# EasyEDA Pro project ESC.epro

# Schematic Schematic1
Board Name: Board1; Create Date: 2024-12-03; Page Name: P1; Project Name: 圈圈机机架电调集成; Schematic Name: Schematic1; Update Date: 2025-01-17; Company: 嘉立创EDA; Page Size: A4; Version: V1.0
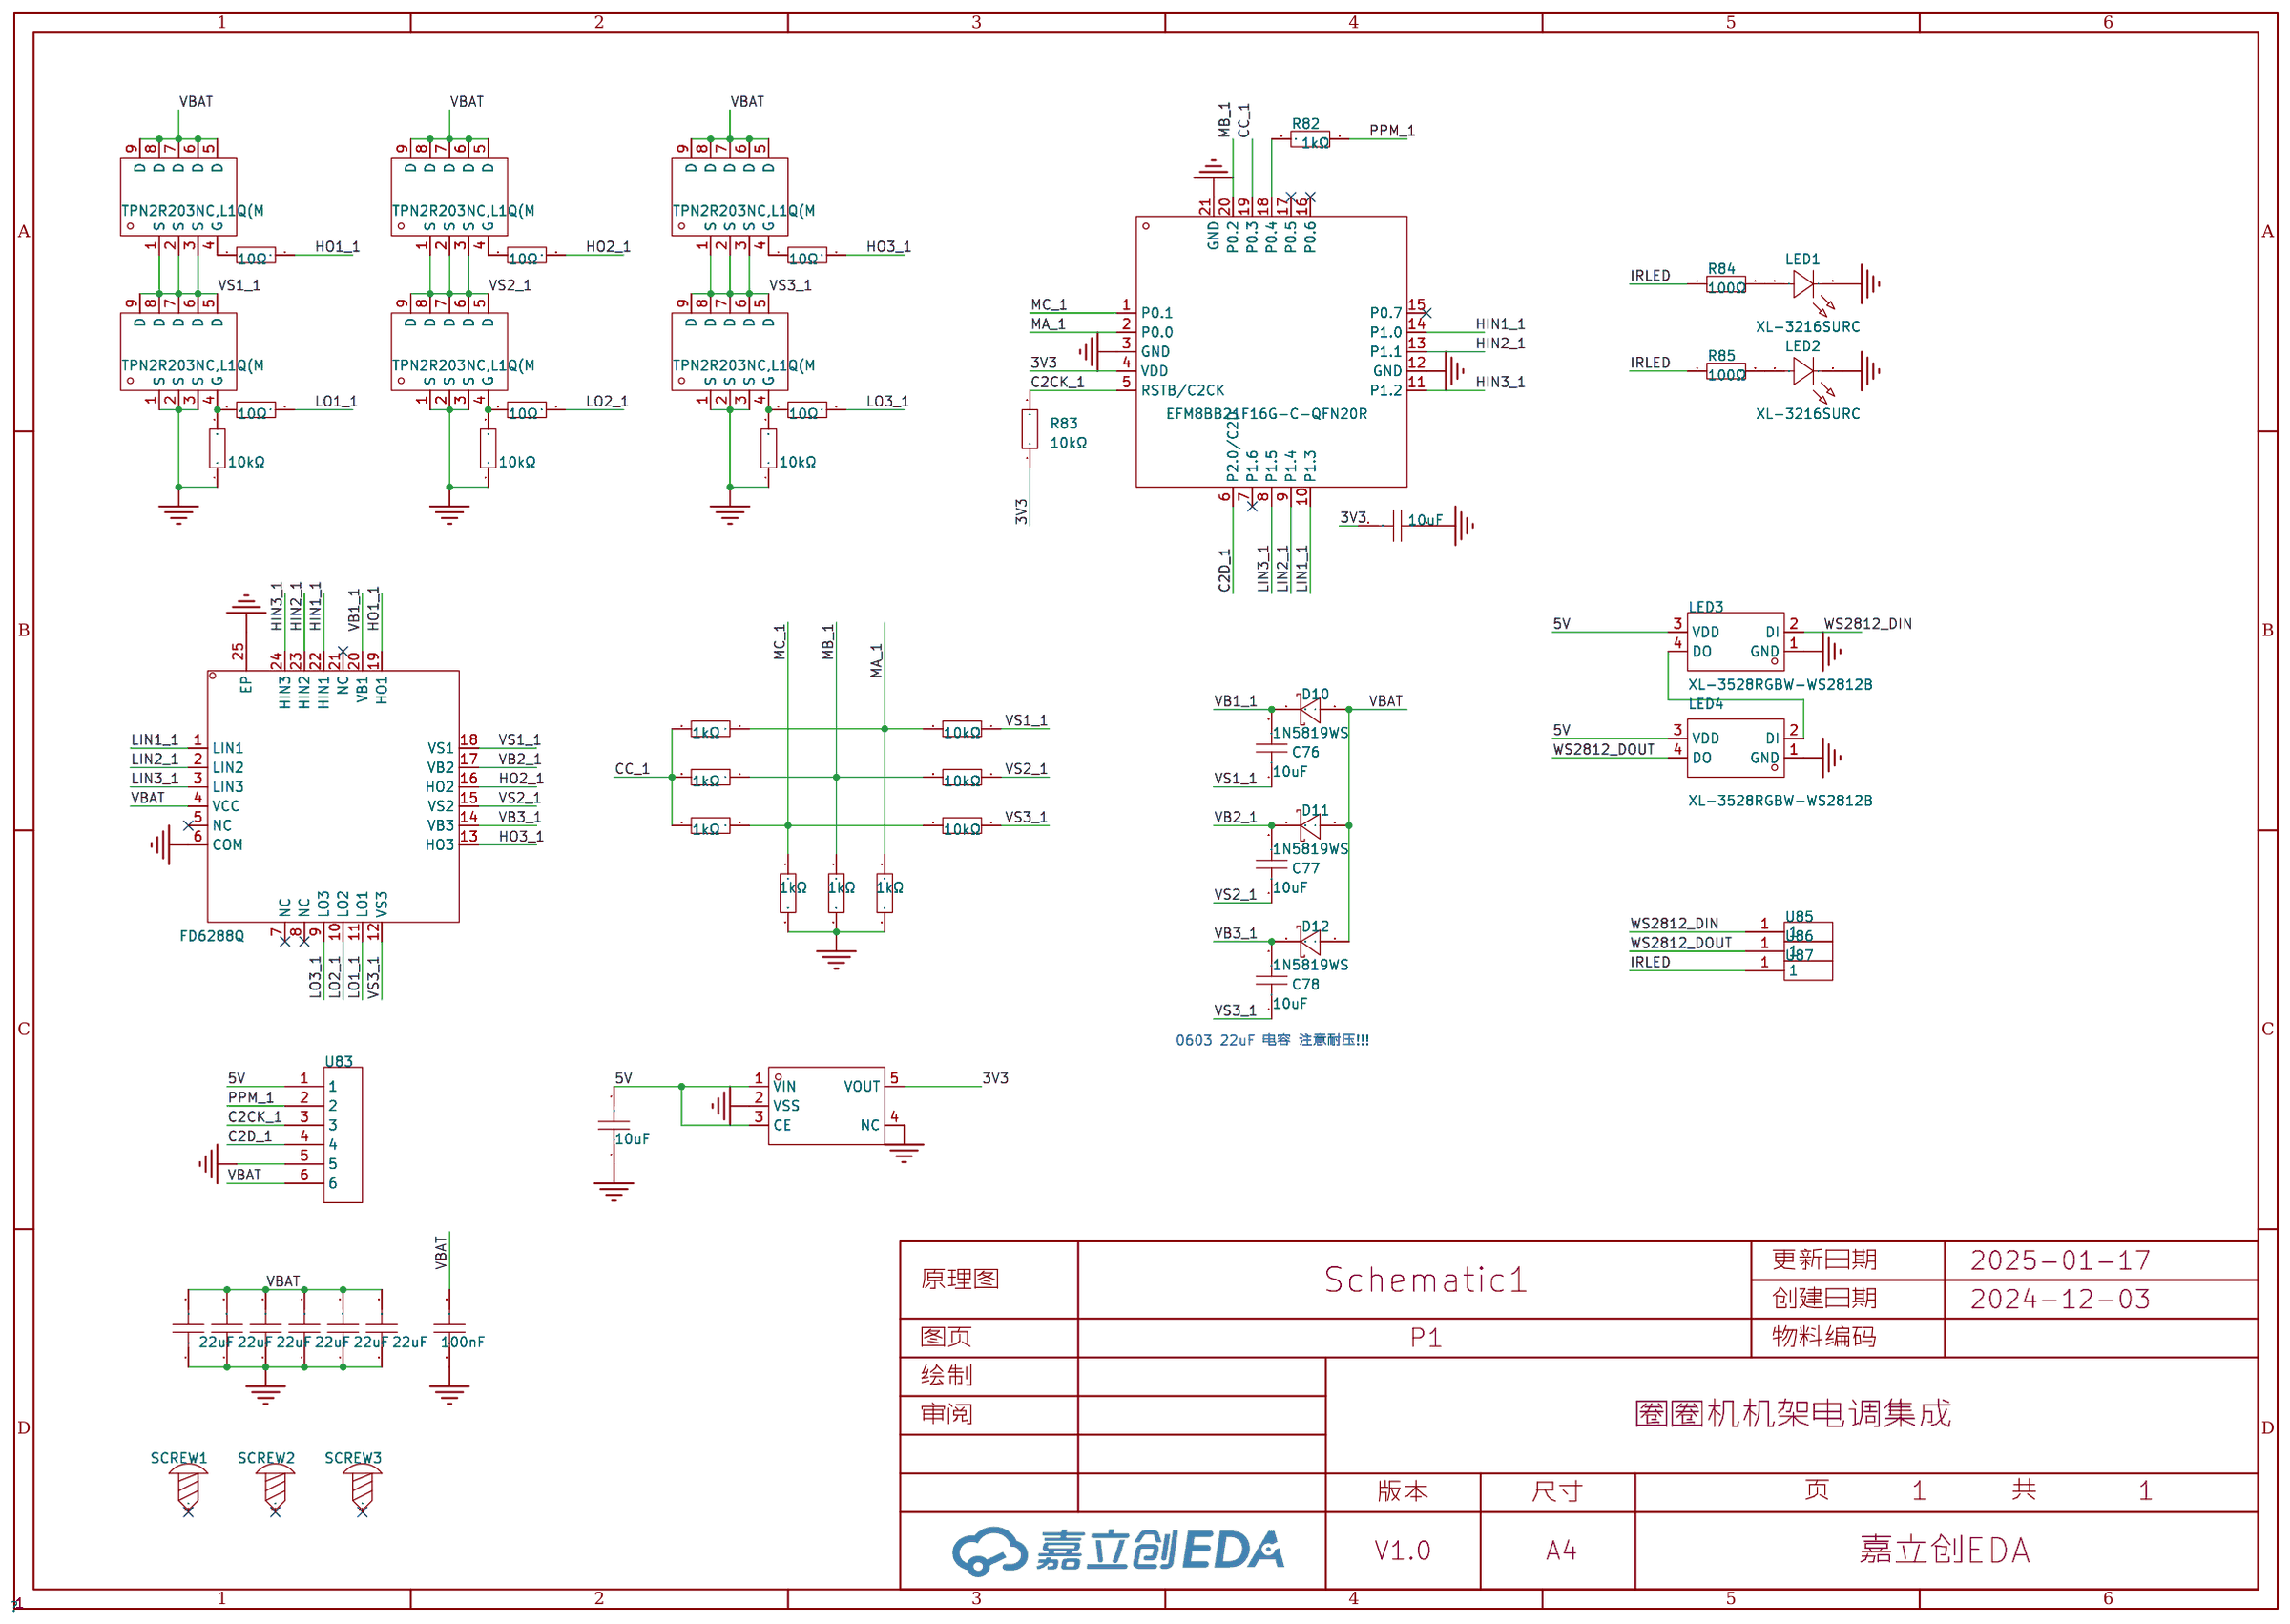
[diagram p0: schematic sheet]

## Parts
C6  10uF  [C0603]
C34  100nF  [C0603]
C45  22uF  [C0805]
C73  22uF  [C0805]
C74  22uF  [C0805]
C75  10uF  [C0603]
C76  10uF  [C0603]
C77  10uF  [C0603]
C78  10uF  [C0603]
C79  22uF  [C0805]
C80  22uF  [C0805]
C81  22uF  [C0805]
D10  1N5819WS  [SOD-323_L1.8-W1.3-LS2.5-RD]
D11  1N5819WS  [SOD-323_L1.8-W1.3-LS2.5-RD]
D12  1N5819WS  [SOD-323_L1.8-W1.3-LS2.5-RD]
LED1  XL-3216SURC  [LED1206-R-RD_RED]
LED2  XL-3216SURC  [LED1206-R-RD_RED]
LED3  XL-3528RGBW-WS2812B  [LED-SMD_4P-L3.5-W2.8-BR-1]
LED4  XL-3528RGBW-WS2812B  [LED-SMD_4P-L3.5-W2.8-BR-1]
Q7  TPN2R203NC,L1Q(M  [TSON-8_L3.1-W3.1-P0.65-LS3.3-BL-EP]
Q8  TPN2R203NC,L1Q(M  [TSON-8_L3.1-W3.1-P0.65-LS3.3-BL-EP]
Q9  TPN2R203NC,L1Q(M  [TSON-8_L3.1-W3.1-P0.65-LS3.3-BL-EP]
Q10  TPN2R203NC,L1Q(M  [TSON-8_L3.1-W3.1-P0.65-LS3.3-BL-EP]
Q11  TPN2R203NC,L1Q(M  [TSON-8_L3.1-W3.1-P0.65-LS3.3-BL-EP]
Q12  TPN2R203NC,L1Q(M  [TSON-8_L3.1-W3.1-P0.65-LS3.3-BL-EP]
R62  10Ω  [R0402]
R63  10Ω  [R0402]
R64  10Ω  [R0402]
R65  10Ω  [R0402]
R66  10Ω  [R0402]
R67  10Ω  [R0402]
R68  10kΩ  [R0402]
R69  10kΩ  [R0402]
R70  10kΩ  [R0402]
R71  10kΩ  [R0402]
R72  10kΩ  [R0402]
R73  10kΩ  [R0402]
R74  1kΩ  [R0402]
R75  1kΩ  [R0402]
R76  1kΩ  [R0402]
R77  1kΩ  [R0402]
R78  1kΩ  [R0402]
R79  1kΩ  [R0402]
R82  1kΩ  [R0603]
R83  10kΩ  [R0603]
R84  100Ω  [R0603]
R85  100Ω  [R0603]
SCREW1  -  [M2螺丝]
SCREW2  -  [M2螺丝]
SCREW3  -  [M2螺丝]
U2  EFM8BB21F16G-C-QFN20R  [QFN-20_L3.0-W3.0-P0.50-BL-EP1.7_EFM8BB21F16G]
U79  ME6217C33M5G  [SOT-23-5_L3.0-W1.7-P0.95-LS2.8-BR]
U82  FD6288Q  [QFN-24_L4.0-W4.0-P0.50-BL-EP2.6]
U83  -  [6pin焊接引出]
U85  -  [1pin焊接引出]
U86  -  [1pin焊接引出]
U87  -  [1pin焊接引出]

## Library data of the parts
C6 C75 = CL10A106KP8NNNC: 容值:10uF;精度:±10%;额定电压:10V;材质(温度系数):X5R;; LCSC Part Name: 10uF ±10% 10V; Supplier Part: C19702; Manufacturer: SAMSUNG(三星); Supplier Footprint: 0603; JLCPCB Part Class: Basic Part; Datasheet: https://atta.szlcsc.com/upload/public/pdf/source/20160218/1457707763339.pdf; Supplier: LCSC; Tolerance: ±10%; Voltage Rated: 10V; Temperature Coefficient: X5R
C34 = CC0603KRX7R9BB104: 容值:100nF;精度:±10%;额定电压:50V;材质(温度系数):X7R;; LCSC Part Name: 100nF ±10% 50V; Supplier Part: C14663; Manufacturer: YAGEO(国巨); Supplier Footprint: 0603; JLCPCB Part Class: Basic Part; Datasheet: https://atta.szlcsc.com/upload/public/pdf/source/20180910/C282072_33301C7F631E79921B82A8DAC6BCC5B3.pdf; Supplier: LCSC; Tolerance: ±10%; Voltage Rated: 50V; Temperature Coefficient: X7R
C45 C73 C74 C79-C81 = CL21A226MAQNNNE: 容值:22uF;精度:±20%;额定电压:25V;材质(温度系数):X5R;; LCSC Part Name: 22uF ±20% 25V; Supplier Part: C45783; Manufacturer: SAMSUNG(三星); Supplier Footprint: 0805; JLCPCB Part Class: 基础库; Datasheet: https://atta.szlcsc.com/upload/public/pdf/source/20160218/1457707763339.pdf; Supplier: LCSC; Tolerance: ±20%; Voltage Rated: 25V; Temperature Coefficient: X5R
C76-C78 = CL10A106MA8NRNC: 容值:10uF;精度:±20%;额定电压:25V;材质(温度系数):X5R;; LCSC Part Name: 10uF ±20% 25V; Supplier Part: C96446; Manufacturer: SAMSUNG(三星); Supplier Footprint: 0603; JLCPCB Part Class: Basic Part; Datasheet: https://atta.szlcsc.com/upload/public/pdf/source/20160218/1457707763339.pdf; Supplier: LCSC; Tolerance: ±20%; Voltage Rated: 25V; Temperature Coefficient: X5R
D10-D12 = 1N5819WS_C191023: 正向压降(Vf):600mV@1A;直流反向耐压(Vr):40V;平均整流电流(Io):1A;; LCSC Part Name: 电压:40V 电流:1A; Supplier Part: C191023; Manufacturer: Hottech(合科泰); Supplier Footprint: SOD-323; JLCPCB Part Class: 基础库; Datasheet: https://atta.szlcsc.com/upload/public/pdf/source/20220428/3CB86FD8D28D653594B4E35F9D5AEFD9.pdf; Supplier: LCSC; Forward Voltage (Vf@If): 600mV@1A; Reverse Voltage (Vr): 40V; Average Rectified Current (Io): 1A
LED1 LED2 = XL-3216SURC: 发光颜色:红色;功率:55mW;正向电流:25mA;主波长:617nm~621nm;透镜颜色:无色透明透镜;色温:-;发光角度:120°;载带方式:正贴;工作温度:-30℃~+85℃;; Supplier Part: C965822; Manufacturer: XINGLIGHT(成兴光); Supplier Footprint: 1206; JLCPCB Part Class: 扩展库; Datasheet: https://atta.szlcsc.com/upload/public/pdf/source/20221102/38B682A5E5FDBBFCA7077B6272CE8E6F.pdf; Supplier: LCSC; Emitted Color: 红色; Power Dissipation: 55mW; Forward Current: 25mA; Dominant Wavelength: 617nm~621nm; Peak Wavelength: 623nm; Lens Color: 无色透明透镜; Viewing Angle: 120°; Mounting Sytle: 正贴; Operating Temperature: -30℃~+85℃
LED3 LED4 = XL-3528RGBW-WS2812B: 3528 七彩幻彩雾状 ws2812B 内置驱动IC; Supplier Part: C2890364; Manufacturer: XINGLIGHT(成兴光); Supplier Footprint: SMD3528-4P; JLCPCB Part Class: 扩展库; Datasheet: https://atta.szlcsc.com/upload/public/pdf/source/20240218/041E1E0D0024617DFFF124D9C311BB4D.pdf; Supplier: LCSC
Q7-Q12 = TPN2R203NC,L1Q(M: 类型:1个N沟道;漏源电压(Vdss):30V;连续漏极电流(Id):45A;功率(Pd):700mW;导通电阻(RDS(on)@Vgs,Id):2.2mΩ@10V,22.5A;阈值电压(Vgs(th)@Id):2.3V@500uA;; LCSC Part Name: 1个N沟道 耐压:30V 电流:45A; Supplier Part: C471286; Manufacturer: TOSHIBA(东芝); Supplier Footprint: TSON-8(3.1x3.1); JLCPCB Part Class: 扩展库; Datasheet: https://atta.szlcsc.com/upload/public/pdf/source/20201217/C471286_B35EDBB339EBB2C97A43CB4DE9269732.pdf; Supplier: LCSC; Type: 1个N沟道; Drain Source Voltage (Vdss): 30V; Continuous Drain Current (Id): 45A; Power Dissipation (Pd): 700mW; Drain Source On Resistance (RDS(on)@Vgs,Id): 2.2mΩ@10V,22.5A; Gate Threshold Voltage (Vgs(th)@Id): 2.3V@500uA
R62-R67 = 0402WGF100JTCE: 电阻类型:厚膜电阻;阻值:10Ω;精度:±1%;功率:62.5mW;最大工作电压:50V;温度系数:±200ppm/℃;; LCSC Part Name: 10Ω ±1% 62.5mW 厚膜电阻; Supplier Part: C25077; Manufacturer: UNI-ROYAL(厚声); Supplier Footprint: 0402; JLCPCB Part Class: Basic Part; Datasheet: https://atta.szlcsc.com/upload/public/pdf/source/20200306/C422600_1E6D84923E4A46A82E41ADD87F860B5C.pdf; Supplier: LCSC; Type: 厚膜电阻; Tolerance: ±1%; Power(Watts): 62.5mW; Overload Voltage (Max): 50V; Temperature Coefficient: ±200ppm/℃; Operating Temperature Range: -55℃~+155℃
R68-R73 = 0402WGF1002TCE: 电阻类型:厚膜电阻;阻值:10kΩ;精度:±1%;功率:62.5mW;最大工作电压:50V;温度系数:±100ppm/℃;; LCSC Part Name: 10kΩ ±1% 62.5mW 厚膜电阻; Supplier Part: C25744; Manufacturer: UNI-ROYAL(厚声); Supplier Footprint: 0402; JLCPCB Part Class: Basic Part; Datasheet: https://atta.szlcsc.com/upload/public/pdf/source/20200306/C422600_1E6D84923E4A46A82E41ADD87F860B5C.pdf; Supplier: LCSC; Type: 厚膜电阻; Tolerance: ±1%; Power(Watts): 62.5mW; Overload Voltage (Max): 50V; Temperature Coefficient: ±100ppm/℃; Operating Temperature Range: -55℃~+155℃
R74-R79 = 0402WGF1001TCE: 电阻类型:厚膜电阻;阻值:1kΩ;精度:±1%;功率:62.5mW;最大工作电压:50V;温度系数:±100ppm/℃;; LCSC Part Name: 1kΩ ±1% 62.5mW 厚膜电阻; Supplier Part: C11702; Manufacturer: UNI-ROYAL(厚声); Supplier Footprint: 0402; JLCPCB Part Class: Basic Part; Datasheet: https://atta.szlcsc.com/upload/public/pdf/source/20200306/C422600_1E6D84923E4A46A82E41ADD87F860B5C.pdf; Supplier: LCSC; Type: 厚膜电阻; Tolerance: ±1%; Power(Watts): 62.5mW; Overload Voltage (Max): 50V; Temperature Coefficient: ±100ppm/℃; Operating Temperature Range: -55℃~+155℃
R82 = 0603WAF1001T5E: 电阻类型:厚膜电阻;阻值:1kΩ;精度:±1%;功率:100mW;最大工作电压:75V;温度系数:±100ppm/℃;; LCSC Part Name: 1kΩ ±1% 100mW 厚膜电阻; Supplier Part: C21190; Manufacturer: UNI-ROYAL(厚声); Supplier Footprint: 0603; JLCPCB Part Class: Basic Part; Datasheet: https://atta.szlcsc.com/upload/public/pdf/source/20200306/C422600_1E6D84923E4A46A82E41ADD87F860B5C.pdf; Supplier: LCSC; Type: 厚膜电阻; Tolerance: ±1%; Power(Watts): 100mW; Overload Voltage (Max): 75V; Temperature Coefficient: ±100ppm/℃; Operating Temperature Range: -55℃~+155℃
R83 = 0603WAF1002T5E: 电阻类型:厚膜电阻;阻值:10kΩ;精度:±1%;功率:100mW;最大工作电压:75V;温度系数:±100ppm/℃;; LCSC Part Name: 厚膜电阻 10kΩ ±1% 100mW; Supplier Part: C25804; Manufacturer: UNI-ROYAL(厚声); Supplier Footprint: 0603; JLCPCB Part Class: Basic Part; Datasheet: https://atta.szlcsc.com/upload/public/pdf/source/20200306/C422600_1E6D84923E4A46A82E41ADD87F860B5C.pdf; Supplier: LCSC; Type: 厚膜电阻; Tolerance: ±1%; Power(Watts): 100mW; Overload Voltage (Max): 75V; Temperature Coefficient: ±100ppm/℃; Operating Temperature Range: -55℃~+155℃
R84 R85 = 0603WAF1000T5E: 电阻类型:厚膜电阻;阻值:100Ω;精度:±1%;功率:100mW;最大工作电压:75V;温度系数:±200ppm/℃;; LCSC Part Name: 100Ω ±1% 100mW 厚膜电阻; Supplier Part: C22775; Manufacturer: UNI-ROYAL(厚声); Supplier Footprint: 0603; JLCPCB Part Class: Basic Part; Datasheet: https://atta.szlcsc.com/upload/public/pdf/source/20200306/C422600_1E6D84923E4A46A82E41ADD87F860B5C.pdf; Supplier: LCSC; Type: 厚膜电阻; Tolerance: ±1%; Power(Watts): 100mW; Overload Voltage (Max): 75V; Temperature Coefficient: ±200ppm/℃; Operating Temperature Range: -55℃~+155℃
SCREW1-SCREW3 = M2螺丝: Supplier Footprint: 插件; Check: false
U2 = EFM8BB21F16G-C-QFN20R: CPU内核:51系列;程序存储容量:16KB;RAM总容量:2.25KB;GPIO端口数量:16;工作电压范围:2.2V~3.6V;CPU最大主频:50MHz;程序存储器类型:FLASH;; Supplier Part: C80713; Manufacturer: SKYWORKS/SILICON LABS(芯科); Supplier Footprint: QFN-20-EP(3x3); JLCPCB Part Class: 扩展库; Datasheet: https://atta.szlcsc.com/upload/public/pdf/source/20160823/1471947533781.pdf; Supplier: LCSC; CPU Core: 51系列; Program Storage Size: 16KB; RAM Size: 2.25KB; GPIO Ports Number: 16; Operating Voltage Range: 2.2V~3.6V; CPU Maximum Speed: 50MHz; Program Memory Type: FLASH; Operating Temperature Range: -40℃~+85℃; ADC (Bit): 12bit; Peripheral/Function: 看门狗；PWM; Internal Oscillator: 有
U79 = ME6217C33M5G: 输出类型:固定;输出极性:正;最大输入电压:7V;输出电压:3.3V;输出电流:800mA;电源纹波抑制比(PSRR):65dB@(1kHz);; Supplier Part: C427602; Manufacturer: MICRONE(南京微盟); Supplier Footprint: SOT-23-5; JLCPCB Part Class: 扩展库; Datasheet: https://atta.szlcsc.com/upload/public/pdf/source/20190910/C427602_D4B9162A2E9D9EF57C60010DFDECEF37.pdf; Supplier: LCSC; Output Type: 固定; Output Polarity: 正; Number of Outputs: 1; Maximum Input Voltage: 7V; Output Voltage: 3.3V; Dropout Voltage: 180mV@(300mA); Output Current: 800mA; Power Supply Rejection Ratio (PSRR): 65dB@(1kHz)
U82 = FD6288Q: Supplier Part: C328453; Manufacturer: Fortior Tech(峰岹); Supplier Footprint: QFN-24-EP(4x4); JLCPCB Part Class: 扩展库; Datasheet: https://atta.szlcsc.com/upload/public/pdf/source/20241101/0E2856EB301EAFFED732065FB088D773.pdf; Supplier: LCSC
U83 = 6pin焊接引出: Check: false
U85-U87 = 1pin焊接引出: Check: false

## Nets
3V3: C6.2 R83.1 U2.4(VDD) U79.5(VOUT)
5V: C75.2 LED3.3(VDD) LED4.3(VDD) U79.1(VIN) U79.3(CE) U83.1
GND: C6.1 C34.1 C45.1 C73.1 C74.1 C75.1 C79.1 C80.1 C81.1 LED1.2(A) LED2.2(A) LED3.1(GND) LED4.1(GND) Q8.1(S) Q8.2(S) Q8.3(S) Q10.1(S) Q10.2(S) Q10.3(S) Q12.1(S) Q12.2(S) Q12.3(S) R68.1 R69.1 R70.1 R77.2 R78.2 R79.2 U2.3(GND) U2.12(GND) U2.21(GND) U79.2(VSS) U79.4(NC) U82.6(COM) U82.25(EP) U83.5
VBAT: C34.2 C45.2 C73.2 C74.2 C79.2 C80.2 C81.2 D10.2(A) D11.2(A) D12.2(A) Q7.5(D) Q7.6(D) Q7.7(D) Q7.8(D) Q7.9(D) Q9.5(D) Q9.6(D) Q9.7(D) Q9.8(D) Q9.9(D) Q11.5(D) Q11.6(D) Q11.7(D) Q11.8(D) Q11.9(D) U82.4(VCC) U83.6
C2CK_1: R83.2 U2.5(RSTB/C2CK) U83.3
C2D_1: U2.6(P2.0/C2D) U83.4
CC_1: R74.2 R75.2 R76.2 U2.19(P0.3)
HIN1_1: U2.14(P1.0) U82.22(HIN1)
HIN2_1: U2.13(P1.1) U82.23(HIN2)
HIN3_1: U2.11(P1.2) U82.24(HIN3)
HO1_1: R62.2 U82.19(HO1)
HO2_1: R63.2 U82.16(HO2)
HO3_1: R64.2 U82.13(HO3)
IRLED: R84.1 R85.1 U87.1
LIN1_1: U2.10(P1.3) U82.1(LIN1)
LIN2_1: U2.9(P1.4) U82.2(LIN2)
LIN3_1: U2.8(P1.5) U82.3(LIN3)
LO1_1: R67.2 U82.11(LO1)
LO2_1: R66.2 U82.10(LO2)
LO3_1: R65.2 U82.9(LO3)
MA_1: R71.2 R74.1 R79.1 U2.2(P0.0)
MB_1: R72.2 R75.1 R78.1 U2.20(P0.2)
MC_1: R73.2 R76.1 R77.1 U2.1(P0.1)
PPM_1: R82.2 U83.2
VB1_1: C76.2 D10.1(K) U82.20(VB1)
VB2_1: C77.2 D11.1(K) U82.17(VB2)
VB3_1: C78.2 D12.1(K) U82.14(VB3)
VS1_1: C76.1 Q7.1(S) Q7.2(S) Q7.3(S) Q8.5(D) Q8.6(D) Q8.7(D) Q8.8(D) Q8.9(D) R71.1 U82.18(VS1)
VS2_1: C77.1 Q9.1(S) Q9.2(S) Q9.3(S) Q10.5(D) Q10.6(D) Q10.7(D) Q10.8(D) Q10.9(D) R72.1 U82.15(VS2)
VS3_1: C78.1 Q11.1(S) Q11.2(S) Q11.3(S) Q12.5(D) Q12.6(D) Q12.7(D) Q12.8(D) Q12.9(D) R73.1 U82.12(VS3)
WS2812_DIN: LED3.2(DI) U85.1
WS2812_DOUT: LED4.4(DO) U86.1
$1N1812: Q10.4(G) R66.1 R69.2
$1N1822: Q12.4(G) R65.1 R70.2
$1N1853: R82.1 U2.18(P0.4)
$1N1932: Q8.4(G) R67.1 R68.2
$1N1933: Q7.4(G) R62.1
$1N1934: Q9.4(G) R63.1
$1N1935: Q11.4(G) R64.1
$1N5489: LED1.1(K) R84.2
$1N5615: LED2.1(K) R85.2
$1N5822: LED3.4(DO) LED4.2(DI)

Not connected (* = marked no-connect by the designer): SCREW1 1*; SCREW2 1*; SCREW3 1*; U2 7(P1.6)* 15(P0.7)* 16(P0.6)* 17(P0.5)*; U82 5(NC)* 7(NC)* 8(NC)* 21(NC)*

## Notes on the sheet
- 0603 22uF 电容 注意耐压!!!

# Board PCB1
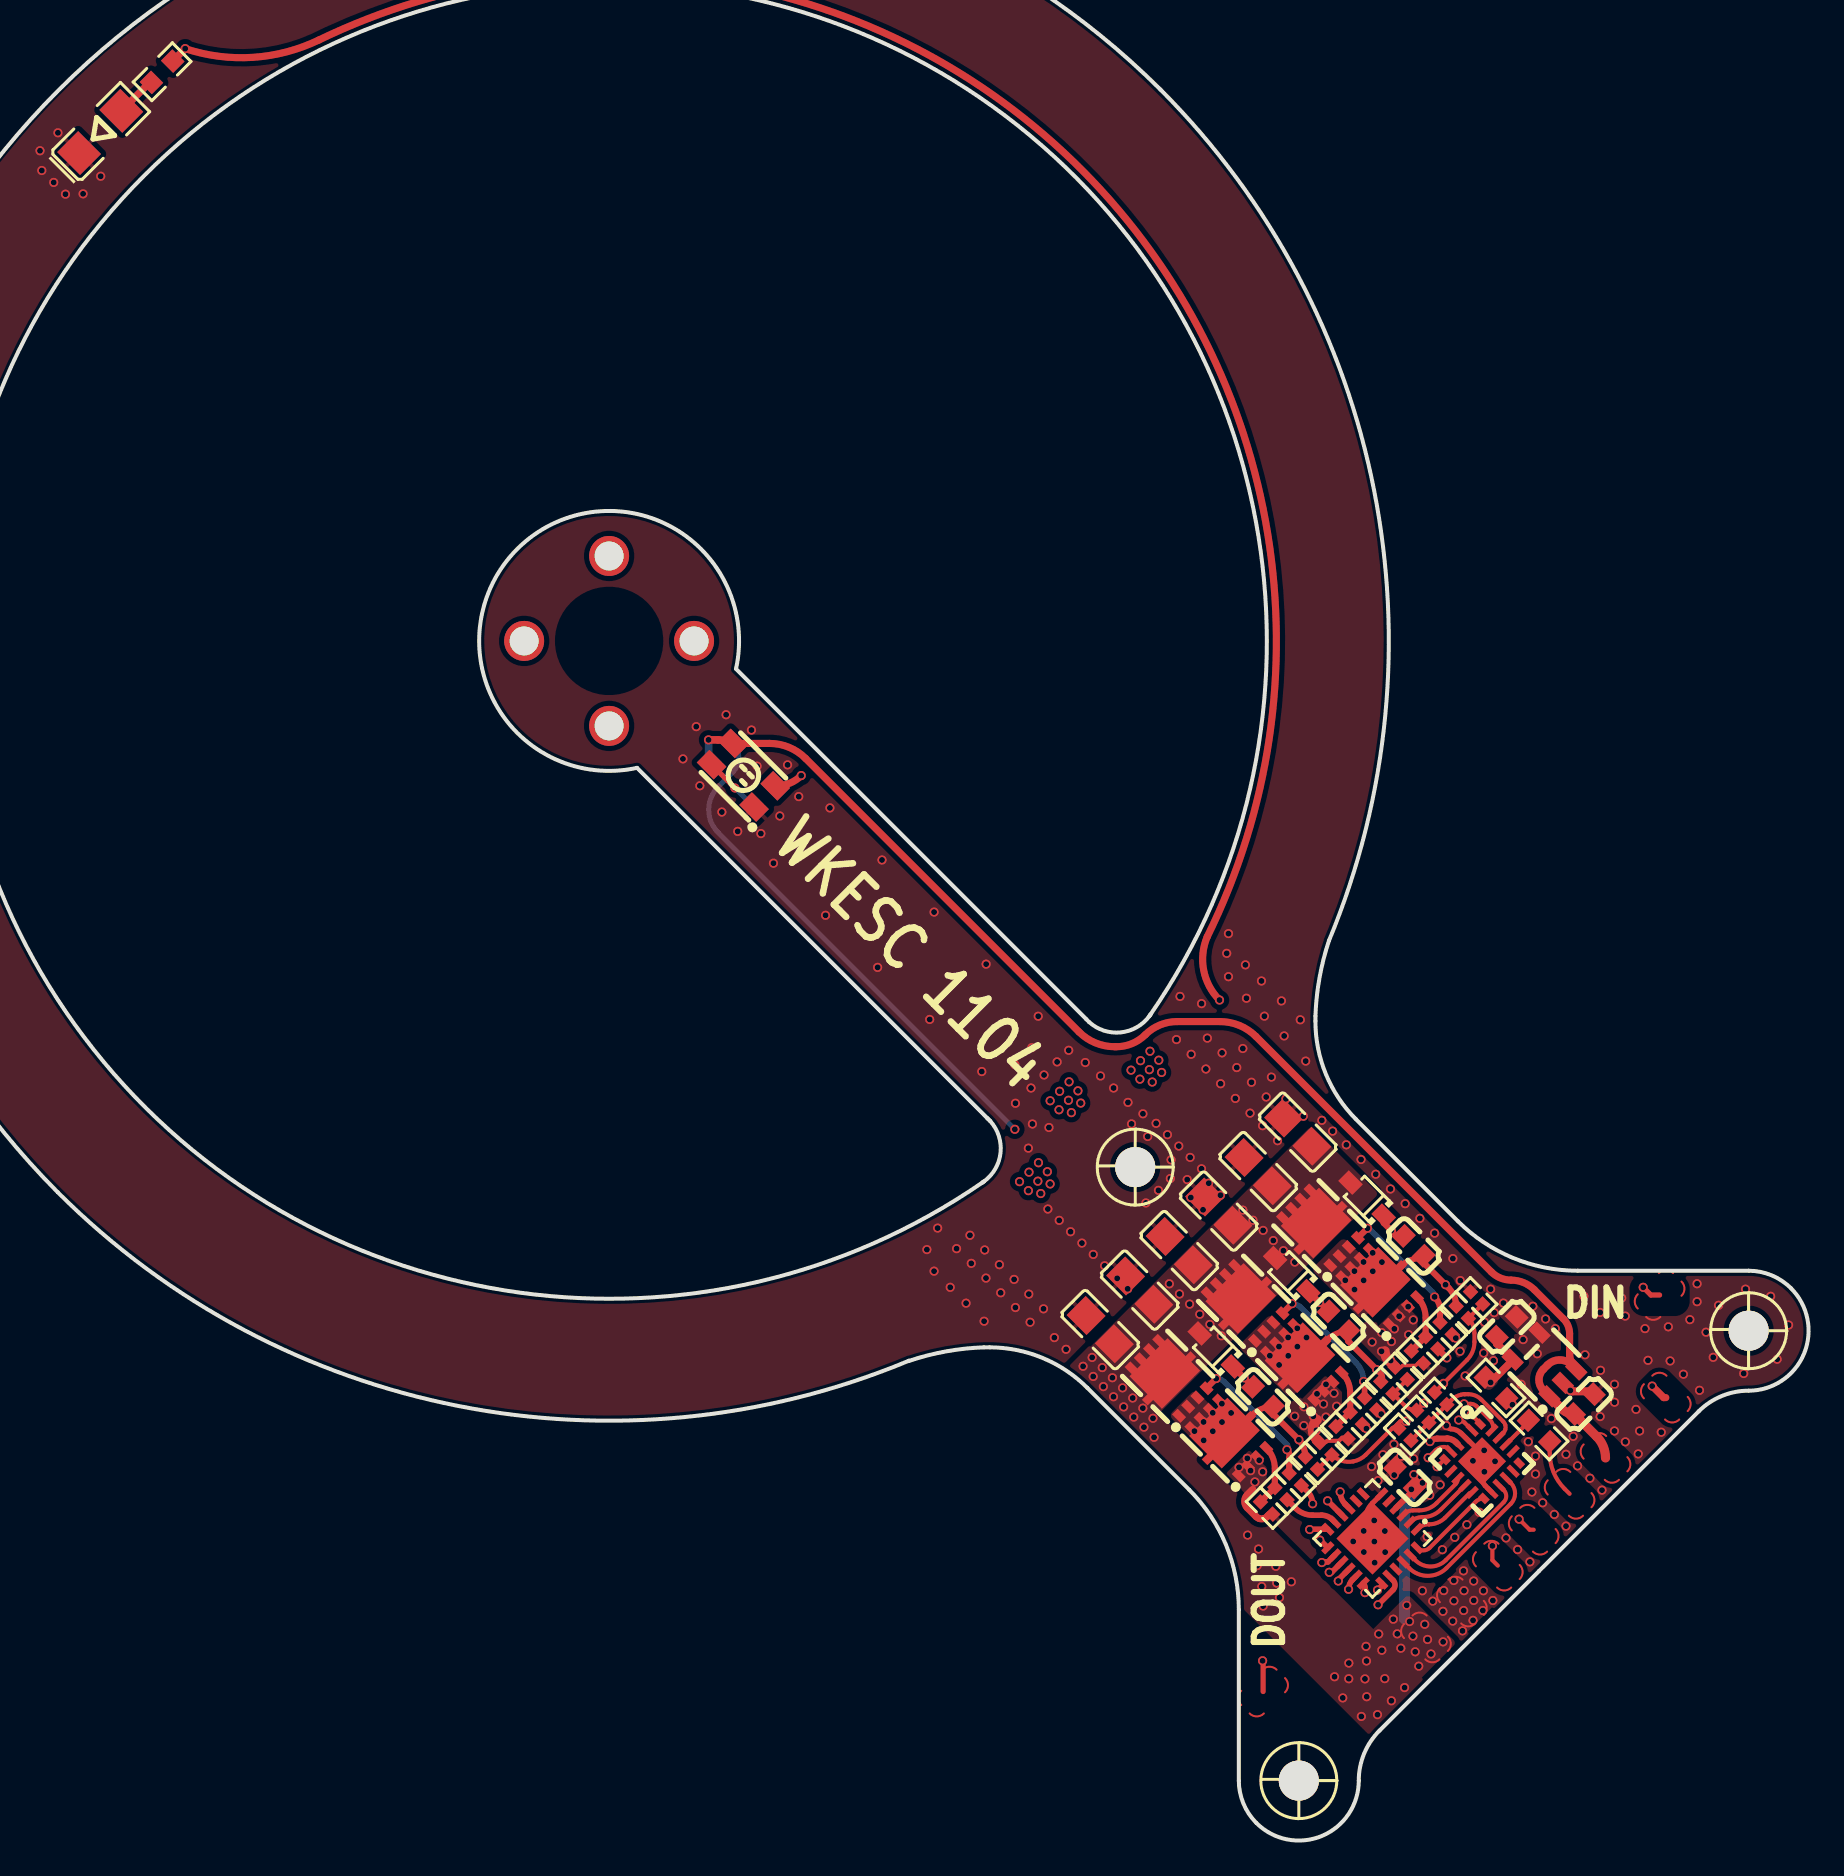
[diagram p1: board, top side]
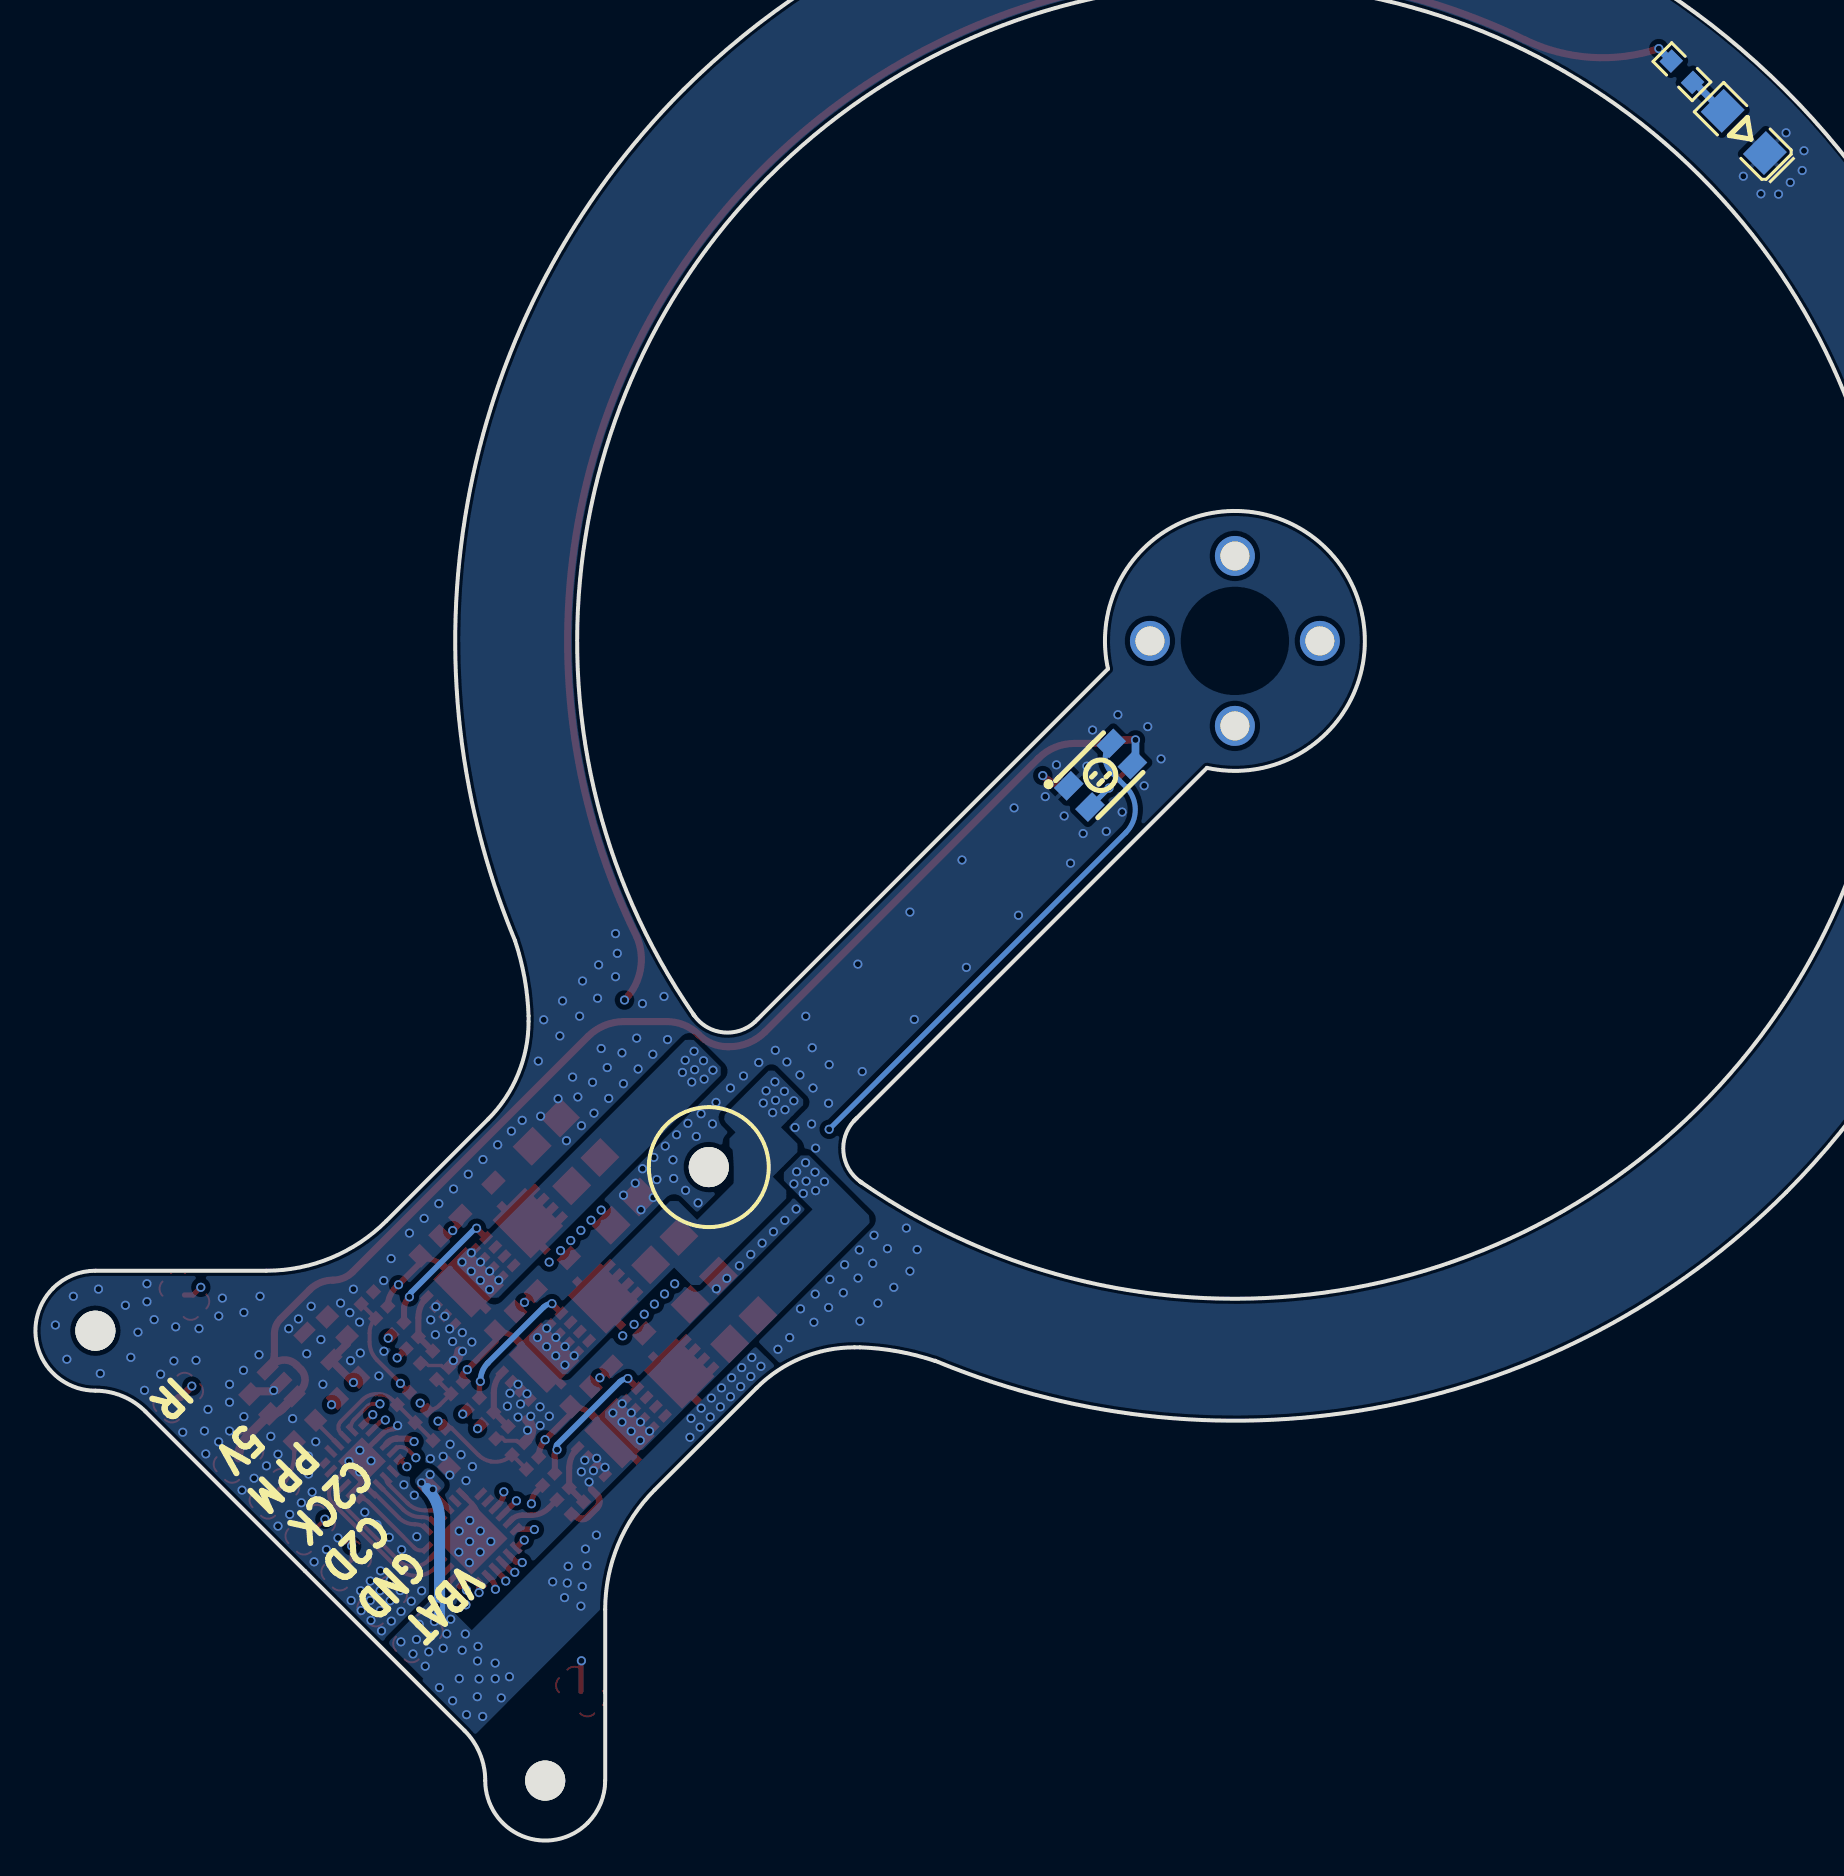
[diagram p2: board, bottom side, seen from below]

Outline 99 x 99 mm; copper layers: Top Layer, Inner1, Inner2, Bottom Layer. Coordinates in mm from the lower left corner of the outline.
Outline path: 57.67,32.92 arc(15.73,83.27) 66.08,41.33 ; 57.67,32.92 arc(57.71,32.94) 57.74,32.96 ; 57.67,32.92 arc(57.71,32.94) 57.74,32.96 ; 66.08,41.33 arc(66.06,41.29) 66.03,41.26 ; 66.08,41.33 arc(66.06,41.29) 66.03,41.26 ; 57.74,32.96 arc(58.58,34.41) 58.06,35.99 ; 57.92,36.13 40.39,53.65 arc(34.4,64.6) 45.35,58.6 62.87,41.08 63.01,40.94 arc(64.59,40.42) 66.03,41.26 ; 57.92,36.13 arc(57.99,36.06) 58.06,35.99 ; 57.92,36.13 58.06,35.99 ; 11.42,32.42 arc(11.42,87.58) 66.57,87.58 arc(77.25,67.57) 75,45.01 arc(74.53,43.15) 74.33,41.25 74.33,40.98 arc(74.86,38.32) 76.36,36.08 81.45,30.99 arc(84.2,29.15) 87.45,28.5 96,28.5 arc(97.15,28.27) 98.12,27.62 arc(98.77,24.35) 96,22.5 arc(94.64,22.23) 93.5,21.47 85.51,13.48 77.53,5.5 arc(76.77,4.35) 76.5,3 arc(74.64,0.23) 71.38,0.88 arc(70.73,1.85) 70.5,3 70.5,11.55 arc(69.85,14.8) 68.01,17.55 62.92,22.64 arc(60.67,24.14) 58.02,24.67 57.75,24.67 arc(55.85,24.47) 53.99,23.99 53.99,24 arc(31.43,21.74) 11.42,32.42
Stack: Top Layer 0.035mm 外层铜厚1oz / Dielectric1 0.2104mm 7628 RC49% 8.6mil / Inner1 0.0152mm 内层铜厚 / Dielectric2 1.065mm 1.1mm H/HOZ Copper / Inner2 0.0152mm 内层铜厚 / Dielectric3 0.2104mm 7628 RC49% 8.6mil / Bottom Layer 0.035mm 外层铜厚1oz

## Design rules (mm)
template: 自定义配置
spacing copperThickness1oz (default): track to track 0.102, other pairs 0.152 to 0.3
spacing copperThickness2oz: track to track 0.203, other pairs 0.152 to 0.3
track width copperThickness1oz (default): min 0.127, default 0.254, max 2.54
track width copperThickness2oz: min 0.203, default 0.254, max 2.54
differential pair differentialPair (default): width min 0.127, default 0.254, max 2.54; gap min 0.152, default 0.152
via viaSize (default): diameter min 0.254, default 0.457, max 10; hole min 0.3, default 0.305, max 6.299

## Placement (name value [footprint] x y rotation side)
C6  10uF  [C0603]  83.9 25.7 225 top
C34  100nF  [C0603]  78.8 18.16 315 top
C45  22uF  [C0805]  63.56 25.56 315 top
C73  22uF  [C0805]  67.51 29.51 315 top
C74  22uF  [C0805]  71.47 33.46 315 top
C75  10uF  [C0603]  87.76 21.84 225 top
C76  10uF  [C0603]  71.7 22.2 135 top
C77  10uF  [C0603]  75.48 25.98 135 top
C78  10uF  [C0603]  79.25 29.75 135 top
C79  22uF  [C0805]  65.54 27.53 315 top
C80  22uF  [C0805]  69.49 31.48 315 top
C81  22uF  [C0805]  73.44 35.44 315 top
D10  1N5819WS  [SOD-323_L1.8-W1.3-LS2.5-RD]  69.37 24.54 135 top
D11  1N5819WS  [SOD-323_L1.8-W1.3-LS2.5-RD]  73.14 28.31 135 top
D12  1N5819WS  [SOD-323_L1.8-W1.3-LS2.5-RD]  76.91 32.08 135 top
LED1  XL-3216SURC  [LED1206-R-RD_RED]  13.54 85.46 45 bottom
LED2  XL-3216SURC  [LED1206-R-RD_RED]  13.54 85.46 45 top
LED3  XL-3528RGBW-WS2812B  [LED-SMD_4P-L3.5-W2.8-BR-1]  45.71 53.28 315 top
LED4  XL-3528RGBW-WS2812B  [LED-SMD_4P-L3.5-W2.8-BR-1]  45.71 53.28 315 bottom
NOREF  -  [Pad_e108]  39 64.25 90 top
NOREF#2  -  [Pad_e110]  43.25 60 90 top
NOREF#3  -  [Pad_e97]  34.75 60 90 top
NOREF#4  -  [Pad_e109]  39 55.75 90 top
Q7  TPN2R203NC,L1Q(M  [TSON-8_L3.1-W3.1-P0.65-LS3.3-BL-EP]  67.01 23.12 45 top
Q8  TPN2R203NC,L1Q(M  [TSON-8_L3.1-W3.1-P0.65-LS3.3-BL-EP]  70 20.14 45 top
Q9  TPN2R203NC,L1Q(M  [TSON-8_L3.1-W3.1-P0.65-LS3.3-BL-EP]  70.81 26.87 45 top
Q10  TPN2R203NC,L1Q(M  [TSON-8_L3.1-W3.1-P0.65-LS3.3-BL-EP]  73.77 23.91 45 top
Q11  TPN2R203NC,L1Q(M  [TSON-8_L3.1-W3.1-P0.65-LS3.3-BL-EP]  74.58 30.64 45 top
Q12  TPN2R203NC,L1Q(M  [TSON-8_L3.1-W3.1-P0.65-LS3.3-BL-EP]  77.54 27.68 45 top
R62  10Ω  [R0402]  73.32 18.07 315 top
R63  10Ω  [R0402]  77.09 21.84 315 top
R64  10Ω  [R0402]  80.86 25.62 315 top
R65  10Ω  [R0402]  80.15 24.9 315 top
R66  10Ω  [R0402]  76.37 21.13 315 top
R67  10Ω  [R0402]  72.6 17.35 315 top
R68  10kΩ  [R0402]  71.88 16.64 135 top
R69  10kΩ  [R0402]  75.66 20.41 135 top
R70  10kΩ  [R0402]  79.43 24.18 135 top
R71  10kΩ  [R0402]  74.13 18.88 315 top
R72  10kΩ  [R0402]  77.9 22.65 315 top
R73  10kΩ  [R0402]  81.67 26.42 315 top
R74  1kΩ  [R0402]  78.8 20.32 315 top
R75  1kΩ  [R0402]  79.7 21.22 315 top
R76  1kΩ  [R0402]  80.6 22.11 315 top
R77  1kΩ  [R0402]  82.39 27.14 135 top
R78  1kΩ  [R0402]  78.62 23.37 135 top
R79  1kΩ  [R0402]  74.85 19.6 135 top
R82  1kΩ  [R0603]  85.51 20.49 315 top
R83  10kΩ  [R0603]  83.36 22.64 315 top
R84  100Ω  [R0603]  16.64 88.47 225 bottom
R85  100Ω  [R0603]  16.64 88.47 225 top
SCREW1  -  [M2螺丝]  65.31 33.68 45 top
SCREW2  -  [M2螺丝]  73.5 3 45 top
SCREW3  -  [M2螺丝]  96 25.5 45 top
U2  EFM8BB21F16G-C-QFN20R  [QFN-20_L3.0-W3.0-P0.50-BL-EP1.7_EFM8BB21F16G]  82.66 18.97 225 top
U79  ME6217C33M5G  [SOT-23-5_L3.0-W1.7-P0.95-LS2.8-BR]  85.78 23.81 315 top
U82  FD6288Q  [QFN-24_L4.0-W4.0-P0.50-BL-EP2.6]  77.18 15.11 135 top
U83  -  [6pin焊接引出]  86.14 16.45 135 top
U85  -  [1pin焊接引出#2]  91.54 27.29 135 top
U86  -  [1pin焊接引出]  71.71 7.45 135 top
U87  -  [1pin焊接引出#3]  91.85 22.16 135 top

## Footprints (pads in the part's own frame, mm; a bottom-side part is the same pattern mirrored in y, then rotated)
1pin焊接引出
  custom 2.485x2.486 smd rot 135: 1(0,0)
1pin焊接引出#2
  custom 2.486x2.485 smd rot 45: 1(0,0)
1pin焊接引出#3
  custom 2.5x1.6 smd: 1(0,0)
6pin焊接引出
  custom 2.5x1.6 smd: 1(0,-3.81) 2(0,-1.27) 3(0,1.27) 4(0,3.81) 5(0,6.35) 6(0,8.89)
C0603
  rect 0.8x0.9 smd: 1(-0.7,0) 2(0.7,0)
C0805
  rect 1.41x1.35 smd: 1(-1,0) 2(1,0)
LED1206-R-RD_RED
  rect 1.485x1.62 smd: 1(1.492,0) 2(-1.492,0)
LED-SMD_4P-L3.5-W2.8-BR-1
  rect 1.2x0.9 smd: 1(1.5,-0.75) 2(1.5,0.75) 3(-1.5,0.75) 4(-1.5,-0.75)
M2螺丝
  round 2 hole 2: 1(0,0)
Pad_e97
  round 2 hole 1.45: 1(0,0)
Pad_e108
  round 2 hole 1.45: 1(0,0)
Pad_e109
  round 2 hole 1.45: 1(0,0)
Pad_e110
  round 2 hole 1.45: 1(0,0)
QFN-20_L3.0-W3.0-P0.50-BL-EP1.7_EFM8BB21F16G
  rect 0.34x0.5 smd: 1(-1.252,-1.377) 6(1.248,-1.377) 11(1.248,1.377) 16(-1.252,1.377)
  rect 0.25x0.7 smd: 2(-0.751,-1.45) 3(-0.252,-1.45) 4(0.248,-1.45) 5(0.749,-1.45) 12(0.749,1.45) 13(0.248,1.45) 14(-0.252,1.45) 15(-0.751,1.45)
  rect 0.7x0.25 smd: 7(1.452,-0.75) 8(1.452,-0.25) 9(1.452,0.25) 10(1.452,0.75) 17(-1.452,0.75) 18(-1.452,0.25) 19(-1.452,-0.25) 20(-1.452,-0.75)
  rect 1.7x1.7 smd: 21(-0.002,0)
QFN-24_L4.0-W4.0-P0.50-BL-EP2.6
  rect 0.28x0.665 smd: 1(-1.25,-1.907) 2(-0.75,-1.907) 3(-0.25,-1.907) 4(0.25,-1.907) 5(0.75,-1.907) 6(1.25,-1.907) 13(1.25,1.907) 14(0.75,1.907) 15(0.25,1.907) 16(-0.25,1.907) 17(-0.75,1.907) 18(-1.25,1.907)
  rect 0.665x0.28 smd: 7(1.907,-1.25) 8(1.907,-0.75) 9(1.907,-0.25) 10(1.907,0.25) 11(1.907,0.75) 12(1.907,1.25) 19(-1.907,1.25) 20(-1.907,0.75) 21(-1.907,0.25) 22(-1.907,-0.25) 23(-1.907,-0.75) 24(-1.907,-1.25)
  rect 2.55x2.55 smd: 25(0,0)
R0402
  rect 0.566x0.54 smd: 1(-0.433,0) 2(0.433,0)
R0603
  rect 0.806x0.864 smd: 1(-0.753,0) 2(0.753,0)
SOD-323_L1.8-W1.3-LS2.5-RD
  rect 1x0.75 smd: 1(-1.173,0) 2(1.173,0)
SOT-23-5_L3.0-W1.7-P0.95-LS2.8-BR
  rect 1x0.6 smd: 1(1.3,-0.95) 2(1.3,0) 3(1.3,0.95) 4(-1.3,0.95) 5(-1.3,-0.95)
TSON-8_L3.1-W3.1-P0.65-LS3.3-BL-EP
  rect 0.4x0.6 smd: 1(-0.975,-1.675) 2(-0.325,-1.675) 3(0.325,-1.675) 4(0.975,-1.675) 5(0.975,1.675) 6(0.325,1.675) 7(-0.325,1.675) 8(-0.975,1.675)
  rect 0.6x0.4 smd: 9(-1.42,0) 9(1.42,0)
  rect 2.7x2.3 smd: 9(0.02,0.325)

## Nets
As in the schematic.

Pads without a net: NOREF 1; NOREF#2 1; NOREF#3 1; NOREF#4 1; SCREW1 1; SCREW2 1; SCREW3 1; U2 7 15 16 17; U82 5 7 8 21

## Via types
v1: diameter 0.457, hole 0.299, Top Layer to Bottom Layer, 423 vias
v2: diameter 0.457, hole 0.305, Top Layer to Bottom Layer, 3 vias
v3: diameter 0.457, hole 0.3, Top Layer to Bottom Layer, 1 via

## Routing (per net, layer and track width the routed paths; a pad name or vN(x,y) marks a point on that pad's centre or on a via; arc(x,y) is an arc through that point)
3V3: length 9.7
  Top Layer w0.305: U2.4 81.36,19.92 arc(81.22,20.03) 81.04,20.09 arc(81,20.1) 80.95,20.11 arc(80.94,20.11) 80.93,20.11 arc(80.92,20.11) 80.9,20.11 80.42,20.11 arc(80.22,20.07) v1(80.06,19.96)
  Top Layer w0.381: v1(83.09,22.91) 84.19,24.02 U79.5 83.4,24.85 C6.2
  Inner1 w0.33: v1(80.06,19.96) 81.25,19.96 arc(81.71,20.05) 82.1,20.31 82.56,20.77 arc(82.95,21.35) 83.09,22.05 v1(83.09,22.91)
5V: length 67
  Top Layer w0.355: 87.04,24.37 87.04,23.9 87.15,23.79 ; 87.04,24.37 87.04,25.35 arc(86.96,25.75) 86.73,26.1 85.28,27.55 arc(84.74,27.91) 84.11,28.03 arc(83.58,28.14) 83.13,28.44 71.35,40.22 arc(70.53,40.77) 69.56,40.96 67.41,40.96 arc(66.55,40.79) 65.82,40.3 arc(65.15,39.86) 64.37,39.71 64.29,39.71 arc(63.32,39.9) 62.5,40.45 48.82,54.13 arc(47.99,54.68) 47.02,54.88 LED3.3 ; 87.04,24.37 arc(87.13,23.93) U79.3
  Top Layer w0.381: v1(43.97,55.05) 44.45,55.05 arc(44.8,54.98) 45.11,54.78 ; U79.1 85.72,22.53 arc(85.51,23.05) 85.72,23.57 85.94,23.79 arc(86.55,24.04) 87.15,23.79
  Top Layer w0.457: U79.1 86.66,21.59 arc(86.94,21.41) C75.2 88.39,20.21 arc(88.72,19.72) U83.1
  Bottom Layer w0.381: v1(43.97,55.05) 43.97,54.28 arc(43.99,54.17) 44.05,54.08
GND: length 19.5
  Top Layer w0.17: 78.59,23.66 78.7,23.76 79.34,23.76 79.58,24.01
  Top Layer w0.2: 74.85,19.93 74.92,20 75.51,20 75.66,20.15 75.84,20.15
  Top Layer w0.254: U2.12 82.82,17.75 arc(82.73,17.89) 82.7,18.04 ; U82.6 77.18,16.88 arc(76.82,15.99) U82.25 ; 80.89,20.74 81,20.63 arc(81.03,20.61) 81.06,20.6 ; 81.1,20.59 arc(81.37,20.53) 81.61,20.38 82.42,19.58 arc(82.45,19.56) 82.49,19.55
  Top Layer w0.35: 71.19,17.57 70.92,17.3 arc(70.79,16.97) 70.92,16.64 71.36,16.21 arc(71.43,16.15) 71.52,16.11 arc(71.64,16.09) 71.75,16.11 arc(71.84,16.15) 71.91,16.21 72.03,16.32
  Top Layer w0.4: 86.83,22.82 87.18,22.47 87.97,22.47
  Top Layer w0.5: 78.32,23.69 77.99,24.02 arc(77.85,24.23) 77.79,24.48 ; 74.53,19.92 74.4,20.05 arc(74.26,20.26) 74.2,20.51 arc(74.24,20.8) 74.4,21.05
  Inner2 w0.5: v1(74.86,22.82) 75.26,22.42 arc(75.27,22.4) v1(75.26,22.38) ; v1(77.63,24.47) 77.17,24.94 arc(77.17,24.94) v1(77.17,24.94) ; v1(70.51,18.67) 71.06,18.12 arc(71.07,18.09) 71.06,18.06 ; v1(74.41,22.35) 74.73,22.02 arc(74.77,21.93) v1(74.73,21.84) ; v1(73.76,21.7) 74.22,21.23 arc(74.22,21.23) v1(74.22,21.22) ; v1(78.13,24.96) 77.68,25.41 arc(77.66,25.42) v1(77.64,25.41) ; v1(70.92,19.12) 71.59,18.45 arc(71.64,18.43) v1(71.69,18.45) ; v1(73.29,21.23) 73.75,20.77 arc(73.75,20.76) v1(73.75,20.76)
  vias: v1(10.53,84.52) v1(10.62,83.53) v1(11.22,82.93) v1(11.43,85.42) v1(11.8,82.35) v1(12.69,82.36) v1(13.57,83.24) v1(42.69,54.1) v1(43.36,55.72) v1(43.54,52.76) v1(44.64,51.44) v1(44.85,56.31) v1(45.43,50.48) v1(46.12,55.55) v1(46.4,53.74) v1(46.59,50.37) v1(47.22,48.88) v1(47.54,51.25) v1(47.92,53.8) v1(48.48,52.22) v1(49.82,46.28) v1(50.04,51.65) v1(52.43,43.67) v1(52.65,49.05) v1(54.89,29.56) v1(55.03,41.07) v1(55.25,46.44) v1(55.25,28.48) v1(55.43,30.64) v1(56.06,27.67) v1(56.38,29.61) v1(56.85,26.88) v1(57.05,30.28) v1(57.11,28.87) v1(57.64,38.46) v1(57.78,29.54) v1(57.75,25.98) v1(57.86,43.84) v1(57.85,28.13) v1(58.52,28.81) v1(58.58,27.4) v1(59.29,38.81) v1(59.32,36.88) v1(59.26,28.07) v1(59.32,26.66) v1(59.97,34.63) v1(59.99,27.33) v1(60.14,39.66) v1(60.1,37.64) v1(60.06,25.93) v1(60.17,35.84) v1(60.46,41.23) v1(60.73,26.6) v1(60.75,38.29) v1(60.94,31.59) v1(61,35.67) v1(61.27,25.16) v1(61.41,38.95) v1(61.51,31.02) v1(61.86,24.57) v1(61.99,39.53) v1(62.08,30.45) v1(62.65,29.89) v1(62.81,38.92) v1(63.21,29.32) v1(63.58,38.24) v1(63.78,28.75) v1(64.23,37.64) v1(64.41,28.12) v1(64.94,27.6) v1(64.95,36.92) v1(65.13,35.84) v1(65.7,36.35) v1(65.94,35.22) v1(65.85,31.89) v1(66.36,35.87) v1(66.48,32.52) v1(66.93,35.31) v1(67.11,34.05) v1(67.07,33.12) v1(67.38,40.06) v1(67.49,34.74) v1(67.55,42.22) v1(67.91,33.06) v1(68.11,39.33) v1(68.06,34.17) v1(68.09,32.16) v1(68.63,41.86) v1(68.63,33.6) v1(68.71,31.55) v1(68.92,40.14) v1(68.85,38.59) v1(68.99,32.88) v1(69.58,37.86) v1(69.58,32.28) v1(69.66,39.4) v1(69.89,44.38) v1(69.98,45.36) v1(69.98,43.21) v1(70.32,37.12) v1(70.39,38.66) v1(70.7,39.62) v1(70.82,43.8) v1(70.88,42.13) v1(71.13,37.93) v1(71.06,36.38) v1(71.08,18.5) v1(71.3,17.94) v1(71.52,19.02) v1(71.63,43) v1(71.68,35.76) v1(71.77,41.23) v1(71.86,37.19) v1(72.13,38.19) v1(72.43,35.01) v1(72.63,42) v1(72.76,40.25) v1(72.85,37.1) v1(73.57,41.05) v1(73.73,36.23) v1(73.84,38.99) v1(74.38,20.52) v1(74.65,36.02) v1(74.85,21.18) v1(75.19,35.49) v1(75.39,21.73) v1(75.87,34.8) v1(76.22,14.96) v1(76.61,34.06) v1(76.74,15.49) v1(76.75,14.43) v1(77.14,18.71) v1(77.35,33.33) v1(77.27,16.01) v1(77.28,14.96) v1(77.29,13.9) v1(77.46,18) v1(77.71,19.3) v1(77.8,15.48) v1(77.82,14.43) v1(78.08,32.59) v1(78.09,24.01) v1(78.28,25.59) v1(78.25,19.82) v1(78.27,18.28) v1(78.52,26.23) v1(78.6,19.22) v1(78.82,31.86) v1(78.97,26.71) v1(78.99,25.3) v1(79.22,26.04) v1(79.24,19.1) v1(79.55,31.12) v1(79.68,12.5) v1(79.92,15.2) v1(80.05,17.27) v1(80.2,11.98) v1(80.29,30.38) v1(80.56,17.8) v1(80.68,14.55) v1(80.75,12.51) v1(80.71,11.47) v1(80.88,20.76) v1(81.2,29.11) v1(81.19,10.98) v1(81.3,15.17) v1(81.25,13.01) v1(81.26,12) v1(81.57,28.01) v1(81.56,24.47) v1(81.73,13.49) v1(81.74,11.51) v1(81.68,10.49) v1(81.82,23.24) v1(81.76,12.5) v1(81.9,15.8) v1(82.21,18.99) v1(82.24,12.98) v1(82.21,11.02) v1(82.25,12.01) v1(82.52,16.43) v1(82.75,24.39) v1(82.73,12.5) v1(82.7,11.51) v1(82.78,25.93) v1(82.77,19.52) v1(82.78,18.45) v1(83.09,27.58) v1(83.23,24) v1(83.2,12.01) v1(83.27,26.41) v1(83.31,18.97) v1(83.73,26.88) v1(83.86,15.14) v1(84.44,14.56) v1(84.62,22.82) v1(84.72,25.06) v1(84.98,19.95) v1(85.06,13.94) v1(85.2,26.73) v1(85.16,17.44) v1(85.33,19.23) v1(85.33,18.33) v1(85.42,24.35) v1(85.69,16.9) v1(85.84,26.09) v1(86.13,21.11) v1(86.33,25.6) v1(86.28,16.31) v1(86.86,19.32) v1(86.86,15.73) v1(87.08,22.51) v1(87.22,20.22) v1(87.44,18.74) v1(87.76,27.22) v1(87.81,24.3) v1(88.06,18.12) v1(88.57,26.42) v1(88.59,23.52) v1(88.57,21.21) v1(88.66,17.53) v1(89.29,22.82) v1(89.29,21.93) v1(89.29,20.49) v1(89.65,27.13) v1(89.83,26.24) v1(89.83,19.94) v1(90.36,21.57) v1(90.54,20.49) v1(90.47,19.34) v1(90.81,25.61) v1(90.96,24.02) v1(91.63,20.43) v1(91.98,25.7) v1(92.07,23.99) v1(92.73,23.33) v1(93.06,26.06) v1(93.42,27.85) v1(93.42,26.95) v1(93.54,22.52) v1(93.87,25.43) v1(94.23,24.17) v1(94.49,26.77) v1(95.84,27.58) v1(95.75,23.36) v1(97.1,27.22) v1(97.42,24.08) v1(98,25.79)
VBAT: length 8.1
  Top Layer w0.305: U82.4 79.29,17.57 arc(79.31,17.62) C34.2
  Bottom Layer w0.55: 78.78,11.09 78.78,16.1 arc(78.9,16.82) 79.26,17.46 arc(79.33,17.54) 79.41,17.61
  vias: v1(62.7,23.72) v1(63.16,24.17) v1(63.21,23.21) v1(63.67,23.66) v1(63.72,22.71) v1(64.17,23.15) v1(64.23,22.2) v1(64.68,22.64) v1(64.73,21.69) v1(65.19,22.14) v1(65.24,21.18) v1(65.7,21.63) v1(65.75,20.68) v1(66.2,21.12) v1(66.26,20.17) v1(67.02,27.85) v1(67.53,27.34) v1(68.03,26.83) v1(68.54,26.33) v1(69.05,25.82) v1(69.62,25.25) v1(70.7,31.53) v1(70.93,15.28) v1(71.2,31.03) v1(71.42,13.75) v1(71.48,14.58) v1(71.64,12.71) v1(71.71,30.52) v1(71.71,11.73) v1(72.22,30.01) v1(72.35,13.72) v1(72.39,12.88) v1(72.53,12.15) v1(72.73,29.51) v1(73.12,12.95) v1(73.3,28.93) v1(75.28,8.2) v1(75.7,7.14) v1(76,8.88) v1(76,8.1) v1(76.62,6.21) v1(76.81,8.09) v1(76.86,9.71) v1(76.88,8.98) v1(76.89,7.2) v1(77.43,6.3) v1(77.49,10.33) v1(77.65,9.52) v1(77.8,8.1) v1(78.13,6.99) v1(78.22,11.07) v1(78.42,10.34) v1(78.6,9.62) v1(78.79,7.65) v1(78.89,11.77) v1(79.04,10.96) v1(79.12,17.57) v1(79.21,10.23) v1(79.25,18.31) v1(79.32,9.44) v1(79.5,8.72) v1(79.68,17.89) v1(79.8,10.82) v1(79.94,10.06) v1(80.11,9.33) v1(80.71,9.94)
C2CK_1: length 12.5
  Top Layer w0.203: v1(79.97,19.15) 80.33,19.51 arc(80.52,19.64) 80.75,19.69 arc(80.87,19.66) 80.98,19.6 U2.5 ; v1(84.52,16.08) 85.04,15.55 U83.3
  Inner1 w0.203: 81.05,19.41 84.29,16.17 arc(84.39,16.1) v1(84.52,16.08) ; 81.05,19.41 80.6,19.41 arc(80.26,19.34) v1(79.97,19.15) ; 81.05,19.41 81.46,19.41 arc(81.89,19.5) 82.25,19.74 84.09,21.58 arc(84.16,21.68) v1(84.18,21.8)
C2D_1: length 7.1
  Top Layer w0.203: U83.4 83.18,14.02 v1(83.18,14.74) ; v1(80.42,18.7) 80.78,19.06 80.8,19.06
  Inner1 w0.203: v1(80.42,18.7) 80.83,18.7 arc(81.17,18.63) 81.45,18.45 82.85,17.05 arc(83.09,16.68) 83.18,16.25 v1(83.18,14.74)
CC_1: length 7
  Top Layer w0.203: R74.2 R75.2 R76.2 81.13,22.04 arc(81.35,22.2) 81.61,22.3 arc(81.68,22.32) 81.76,22.33 arc(81.78,22.33) 81.79,22.33 arc(81.81,22.33) 81.83,22.33 81.97,22.33 arc(82.33,22.26) 82.63,22.06 83.72,20.96 arc(83.79,20.88) 83.83,20.78 arc(83.84,20.67) 83.83,20.57 arc(83.79,20.47) 83.72,20.39 83.51,20.17
HIN1_1: length 8.5
  Top Layer w0.203: 78.71,13.94 79.02,13.63 arc(79.95,13.24) 80.88,13.63 84.1,16.85 arc(84.32,17.37) 84.1,17.89 83.86,18.12
HIN2_1: length 7.2
  Top Layer w0.203: 83.51,17.77 83.75,17.53 arc(83.87,17.23) 83.75,16.92 80.85,14.02 arc(80.09,13.71) 79.33,14.02 U82.23
HIN3_1: length 4.4
  Top Layer w0.203: 82.34,16.94 80.04,14.64 arc(79.73,14.51) U82.24 ; 82.34,16.95 arc(82.53,17.07) U2.11
HO1_1: length 7.1
  Top Layer w0.28: U82.19 77.65,12.75 v1(77.43,12.53) ; R62.2 73.93,17.46 arc(74.12,17.18) v1(74.19,16.85)
  Inner2 w0.28: v1(77.43,12.53) arc(77.37,12.87) 77.17,13.16 74.68,15.65 arc(74.32,16.2) v1(74.19,16.85)
HO2_1: length 11.2
  Top Layer w0.28: v1(77.62,21.33) 77.42,21.54 R63.2 ; U82.16 75.47,13.04 v1(75.47,12.98)
  Inner1 w0.28: v1(75.47,12.98) 75.75,13.26 arc(75.89,13.61) 75.75,13.96 75.57,14.14 arc(75.33,14.72) 75.57,15.29 76.37,16.1 arc(76.89,17.23) 76.54,18.42 ; 76.44,18.54 arc(76.32,19.03) 76.54,19.49 77.62,20.58 arc(77.78,20.95) v1(77.62,21.33) ; 76.44,18.54 arc(76.49,18.48) 76.54,18.42 ; 76.44,18.54 arc(76.49,18.48) 76.54,18.42
HO3_1: length 14.8
  Top Layer w0.28: U82.13 74.56,15.03 v1(74.55,15.03)
  Top Layer w0.305: v1(81.35,25.13) R64.2
  Inner1 w0.28: v1(81.35,25.13) 81.04,25.13 arc(80.43,25.01) 79.91,24.66 75.83,20.58 arc(75.35,19.42) 75.83,18.26 75.93,18.16 arc(76.29,17.29) 75.93,16.41 v1(74.55,15.03)
IRLED: length 125.3
  Top Layer w0.355: R85.1 v1(17.79,89.63) arc(21.18,89.19) 24.48,90.06 arc(62.71,83.49) 68.91,45.2 arc(68.74,43.53) v1(69.53,42.04) ; U87.1 91.75,22.16 v1(91.17,22.73)
  Inner2 w0.355: v1(91.17,22.73) 86.25,27.66 arc(85.89,27.91) 85.46,28.04 ; v1(69.53,42.04) 82.02,29.55 arc(83.53,28.5) 85.31,28.05 ; 85.31,28.05 arc(85.39,28.04) 85.46,28.04 ; 85.31,28.05 arc(85.39,28.04) 85.46,28.04
  Bottom Layer w0.355: v1(17.79,89.63) R85.1
LIN1_1: length 3.4
  Top Layer w0.203: U82.1 arc(79.69,15.75) 80.01,15.82 80.01,15.82 arc(80.45,15.91) 80.82,16.15 82.02,17.35 arc(82.09,17.4) U2.10
LIN2_1: length 3.4
  Top Layer w0.203: U2.9 80.6,16.55 arc(80.18,16.28) 79.69,16.18 79.67,16.18 arc(79.34,16.11) U82.2
LIN3_1: length 3.5
  Top Layer w0.203: U82.3 78.77,16.34 arc(78.96,16.47) 79.19,16.52 79.51,16.52 arc(79.98,16.61) 80.38,16.88 81.34,17.83 arc(81.43,17.96) 81.46,18.12
LO1_1: length 2.8
  Top Layer w0.28: U82.11 75.18,16.05 arc(74.93,16.22) 74.63,16.28 74.18,16.28 arc(73.72,16.37) 73.32,16.63 R67.2
LO2_1: length 5.6
  Top Layer w0.28: R66.2 76.68,20.8 v1(76.88,20.6) ; v1(74.94,16.99) 74.94,16.99 U82.10
  Inner2 w0.28: v1(76.88,20.6) 75.68,19.4 arc(75.13,18.58) 74.94,17.61 v1(74.94,16.99)
LO3_1: length 10.4
  Top Layer w0.28: U82.9 75.82,16.82 arc(75.63,17.11) v1(75.57,17.44)
  Top Layer w0.305: v1(80.9,24.14) R65.2
  Inner2 w0.28: v1(75.57,17.44) 75.57,17.49 arc(75.76,18.46) 76.31,19.28 80.71,23.69 arc(80.85,23.9) v1(80.9,24.14)
MA_1: length 9.9
  Top Layer w0.203: v1(78.86,20.98) 78.58,20.98 78.28,20.68 ; 78.28,20.68 arc(78.22,20.66) 78.17,20.62 76.84,19.29 arc(76.55,19.08) 76.22,18.96 arc(75.65,19) 75.15,19.29 R71.2 ; 78.28,20.68 arc(78.4,20.68) R74.1 ; U2.2 81.77,20.92 arc(81.65,21.01) v1(81.49,21.04)
  Inner1 w0.203: v1(81.49,21.04) 81.04,21.48 arc(80.77,21.6) 80.51,21.48 80,20.98 arc(79.43,20.74) v1(78.86,20.98)
MB_1: length 7.6
  Top Layer w0.203: 78.93,23.06 R72.2 78.78,21.78 arc(79.06,21.59) R75.1 v1(79.75,21.88) ; v1(81.76,21.84) 82.1,21.84 arc(82.25,21.81) 82.39,21.72 83.04,21.07 arc(83.18,20.86) 83.23,20.62 83.23,20.6 U2.20
  Inner1 w0.203: v1(81.76,21.84) 81.49,22.11 arc(81.04,22.3) 80.6,22.11 80.36,21.88 arc(80.06,21.75) v1(79.75,21.88)
MC_1: length 9
  Top Layer w0.203: R76.1 v1(80.74,22.87) 81.91,24.04 arc(82.18,24.45) 82.28,24.94 82.28,25.39 arc(82.2,25.78) R73.2 R77.1 ; v1(82.12,21.31) 82.57,20.86 82.57,20.83
  Inner1 w0.203: v1(80.74,22.87) arc(81.1,23.02) 81.46,22.87 82.12,22.2 arc(82.31,21.75) v1(82.12,21.31)
PPM_1: length 2.9
  Top Layer w0.203: R82.2 86.05,19.39 arc(86.24,18.42) 86.79,17.6 U83.2
VB1_1: length 21.6
  Top Layer w0.28: 71.21,22.7 v1(70.76,23.15) ; v1(77.46,11.79) 78.21,12.54 arc(78.31,12.79) 78.21,13.03
  Top Layer w0.305: D10.1 v1(70.76,23.15)
  Inner1 w0.28: v1(77.46,11.79) arc(76.37,11.34) 75.29,11.79 67.79,19.29 arc(67.48,20.05) 67.79,20.81 69.69,22.7 arc(70.18,23.03) v1(70.76,23.15)
VB2_1: length 22.6
  Top Layer w0.28: U82.17 76.18,13.05 arc(76.04,12.83) v1(75.99,12.57) ; C77.2 v1(74.53,26.92)
  Top Layer w0.305: 73.97,27.48 v1(74.53,26.92)
  Inner1 w0.28: v1(74.53,26.92) 75.12,26.33 arc(75.42,25.62) 75.12,24.9 69.64,19.42 arc(69.36,18.74) 69.64,18.06 75.13,12.57 arc(75.56,12.39) v1(75.99,12.57)
VB3_1: length 24.9
  Top Layer w0.28: v1(74.65,13.91) 74.77,13.91 74.8,13.94 74.95,13.94 U82.14 ; v1(78.12,30.51) 78.39,30.24 C78.2
  Top Layer w0.305: 77.74,31.25 77.74,30.89 v1(78.12,30.51)
  Inner1 w0.28: v1(78.12,30.51) arc(78.81,28.85) 78.12,27.19 70.06,19.12 arc(69.89,18.7) 70.06,18.28 74.28,14.06 arc(74.45,13.95) v1(74.65,13.91)
VS1_1: length 16.2
  Top Layer w0.28: v1(76.81,12.4) 76.81,12.66 arc(76.78,12.78) U82.18 ; Q8.9 71.12,21.26 arc(71.62,21.59) 72.2,21.71
  Top Layer w0.305: 72.2,21.71 72.2,21.35 73.44,20.11 arc(73.72,19.68) 73.82,19.19
  Inner2 w0.28: v1(76.81,12.4) 76.81,12.4 76.58,12.17 arc(76.5,12.11) 76.42,12.05 arc(76.05,11.95) 75.69,12.05 arc(75.61,12.11) 75.53,12.17 73,14.7 arc(72.15,16.77) 73,18.83 73.5,19.33 arc(73.65,19.69) v1(73.5,20.05)
  vias: v1(59.53,32.96) v1(60,33.43) v1(59.97,32.51) v1(60.44,32.98) v1(60.47,33.91) v1(60.59,32.36) v1(60.92,33.46) v1(61.06,32.84) v1(68.28,20.48) v1(68.73,20.94) v1(68.74,20.02) v1(69.19,21.4) v1(69.2,20.48) v1(69.65,21.85) v1(69.65,20.93) v1(70.11,21.39)
VS2_1: length 18.9
  Top Layer w0.28: v1(75.02,13.42) 75.14,13.42 75.66,13.94 ; v1(77.39,23.56) 77.6,23.36 arc(77.68,23.16) R72.1 ; Q10.9 74.89,25.03 arc(75.39,25.36) C77.1 ; 75.97,25.53 76.11,25.53
  Top Layer w0.305: C77.1 75.97,24.98 v1(77.39,23.56)
  Inner2 w0.28: v1(77.39,23.56) arc(77.42,23.53) 77.44,23.51 arc(77.57,23.09) 77.39,22.68 73.37,18.66 arc(72.7,17.04) 73.37,15.42 74.16,14.63 arc(74.17,14.63) 74.17,14.62 arc(74.39,14.48) 74.65,14.43 arc(74.85,14.39) 75.01,14.28 75.09,14.2 arc(75.18,14.07) 75.21,13.92 75.21,13.87 arc(75.16,13.63) v1(75.02,13.42)
  vias: v1(61.06,37) v1(61.53,37.48) v1(61.5,36.55) v1(62.01,37.95) v1(61.98,37.03) v1(62.12,36.41) v1(62.45,37.5) v1(62.59,36.89) v1(72.05,24.25) v1(72.51,24.71) v1(72.51,23.79) v1(72.96,25.17) v1(72.97,24.25) v1(73.42,25.62) v1(73.43,24.7) v1(73.88,25.16)
VS3_1: length 21
  Top Layer w0.28: 78.55,28.69 78.58,28.72 arc(79.01,29.01) 79.53,29.11 ; U82.12 74.08,15.57 arc(74.06,15.57) v1(74.04,15.56)
  Top Layer w0.305: 79.53,29.11 v1(80.83,27.8) 80.99,27.65 arc(81.27,27.23) R73.1
  Inner2 w0.28: v1(80.83,27.8) 80.92,27.71 arc(81.35,26.69) 80.92,25.68 73.82,18.57 arc(73.24,17.17) 73.82,15.78 v1(74.04,15.56)
  vias: v1(65.1,38.53) v1(65.58,39.01) v1(65.55,38.08) v1(66.02,38.56) v1(66.05,39.48) v1(66.17,37.94) v1(66.49,39.03) v1(66.63,38.42) v1(75.82,28.02) v1(76.28,28.48) v1(76.28,27.56) v1(76.73,28.94) v1(76.74,28.02) v1(77.19,29.4) v1(77.2,28.48) v1(77.65,28.93)
WS2812_DIN: length 55.3
  Top Layer w0.254: v1(90.72,27.67) 91.11,27.29 U85.1
  Top Layer w0.355: LED3.2 47.37,52.75 arc(48.04,52.89) v1(48.61,53.27)
  Inner1 w0.254: v1(48.61,53.27) 48.81,53.27 arc(49.78,53.07) 50.61,52.52 62.74,40.39 arc(63.4,39.95) 64.17,39.8 64.6,39.8 arc(65.26,39.93) 65.81,40.3 arc(66.55,40.79) 67.42,40.96 69.38,40.96 arc(70.35,40.77) 71.17,40.22 81.62,29.77 arc(83.55,28.48) 85.82,28.03 89.86,28.03 arc(90.33,27.94) v1(90.72,27.67)
WS2812_DOUT: length 64.3
  Top Layer w0.254: U86.1 71.71,8.97 v1(71.68,8.99)
  Inner1 w0.254: v1(59.29,35.58) 59.29,34.1 arc(59.2,33.64) 58.94,33.25 55.88,30.19 arc(55.62,29.56) 55.88,28.93 59.38,25.43 arc(60.01,25.17) 60.64,25.43 61.05,25.84 arc(61.72,26.11) 62.38,25.84 66.58,21.65 arc(66.9,21.16) 67.02,20.58 67.02,19.93 arc(67.11,19.45) 67.38,19.04 68.26,18.17 arc(70.33,15.07) 71.06,11.41 71.06,10.51 arc(71.22,9.69) v1(71.68,8.99)
  Bottom Layer w0.254: v1(59.29,35.58) 44.46,50.41 arc(43.98,51.56) 44.46,52.71 45.18,53.44 arc(45.48,54.16) LED4.4
$1N1812: length 3.1
  Top Layer w0.305: R69.2 R66.1 76.07,22.39 arc(75.96,22.94) 75.64,23.41
$1N1822: length 3.1
  Top Layer w0.305: R70.2 79.84,25.2 79.84,26.16 arc(79.73,26.72) 79.42,27.19
$1N1853: length 1.7
  Top Layer w0.203: R82.1 84.98,20.94 83.86,19.82
$1N1932: length 3.1
  Top Layer w0.305: R68.2 R67.1 72.3,18.62 arc(72.19,19.17) 71.87,19.64
$1N1933: length 7.1
  Top Layer w0.305: v2(69.36,23.11) 68.88,22.63 68.88,22.63 ; R62.1 73.01,19.13 arc(73.02,19.35) v2(72.9,19.55)
  Bottom Layer w0.28: v2(69.36,23.11) arc(69.58,23.07) 69.77,22.94 72.9,19.81 arc(72.96,19.68) v2(72.9,19.55)
$1N1934: length 6.9
  Top Layer w0.28: R63.1 76.79,22.85 arc(76.77,22.92) v1(76.74,22.97)
  Top Layer w0.305: Q9.4 v2(73.16,26.86)
  Bottom Layer w0.28: v1(76.74,22.97) arc(76.65,23.45) 76.39,23.87 arc(76.37,23.89) 76.35,23.9 73.57,26.69 arc(73.38,26.81) v2(73.16,26.86)
$1N1935: length 6.9
  Top Layer w0.305: R64.1 80.56,26.67 arc(80.47,26.95) v1(80.29,27.19) ; Q11.4 v3(76.93,30.63)
  Bottom Layer w0.28: v3(76.93,30.63) arc(76.99,30.62) 77.04,30.58 80.19,27.43 arc(80.26,27.32) v1(80.29,27.19)
$1N5489: length 2.1
  Bottom Layer w0.355: LED1.1 16.02,87.94 R84.2
$1N5615: length 2.1
  Top Layer w0.355: R85.2 16.02,87.94 LED2.1
$1N5822: length 3
  Top Layer w0.254: LED3.4 v1(45.29,52.65)
  Bottom Layer w0.254: v1(45.29,52.65) LED4.2

## Copper pours and planes (outline as drawn; the poured copper is in the pictures)
GND on Top Layer: 77.2,26.9 79.37,26.9 79.37,24.74 77.2,24.74
GND on Top Layer: 73.35,23.22 75.6,23.22 75.6,20.98 73.35,20.98
GND on Top Layer: 79.86,13.75 83.45,13.75 83.45,10.16 79.86,10.16
GND on Top Layer: 69.9,19.49 71.83,19.49 71.83,17.56 69.9,17.56
GND on Top Layer: -31.41,59.28 35.49,126.19 125.66,36.02 58.75,-30.88
GND on Top Layer: 83.44,27.41 86.51,27.41 86.51,24.34 83.44,24.34
GND on Bottom Layer: -31.41,59.28 35.49,126.19 125.66,36.02 58.75,-30.88
GND on Inner1: -31.41,59.28 35.49,126.19 125.66,36.02 58.75,-30.88
GND on Inner2: -31.4,59.29 35.5,126.19 125.66,36.03 58.76,-30.87
VBAT on Top Layer: 60.28,22.02 63.03,24.77 80.35,7.45 77.6,4.69
VBAT on Top Layer: 74.91,12.23 81.3,12.23 81.3,5.84 74.91,5.84
VBAT on Top Layer: 62.29,35.65 77.41,35.65 77.41,20.53 62.29,20.53
VBAT on Top Layer: 65.21,21.74 67.2,21.74 67.2,19.75 65.21,19.75
VBAT on Bottom Layer: 78.53,18.62 80.01,18.62 80.01,17.14 78.53,17.14
VBAT on Bottom Layer: 60.27,22.02 62.98,24.72 80.31,7.38 77.61,4.68
VBAT on Bottom Layer: 74.91,12.23 81.3,12.23 81.3,5.84 74.91,5.84
VBAT on Inner2: 66.7,15.6 69.45,18.34 80.36,7.43 77.61,4.68
VBAT on Inner2: 74.91,12.23 81.3,12.23 81.3,5.84 74.91,5.84
VBAT on Inner2: 61.36,23.09 70.61,32.34 77.34,25.61 68.09,16.36
VS1_1 on Top Layer: 67.09,22.46 70.79,22.46 70.79,18.76 67.09,18.76
VS1_1 on Bottom Layer: 57.27,34.27 70.51,34.27 70.51,19.51 57.27,19.51
VS1_1 on Inner2: 57.29,34.27 70.37,34.27 70.37,19.74 57.29,19.74
VS2_1 on Top Layer: 70.55,26.23 74.56,26.23 74.56,22.22 70.55,22.22
VS2_1 on Bottom Layer: 60.59,38.51 74.29,38.51 74.29,23.32 60.59,23.32
VS2_1 on Inner2: 60.59,38.51 74.14,38.51 74.14,23.42 60.59,23.42
VS3_1 on Top Layer: 74.22,30.07 78.14,30.07 78.14,26.15 74.22,26.15
VS3_1 on Bottom Layer: 64.71,40.05 77.9,40.05 77.9,27.15 64.71,27.15
VS3_1 on Inner2: 64.71,40.05 77.9,40.05 77.9,27.11 64.71,27.11

Small or netless copper shapes (teardrops, artwork), in the pictures only: 1 on Top Layer

## Text on the board
Bottom Silkscreen Layer: VBAT | GND | C2D | C2CK | PPM | 5V | IR
Top Silkscreen Layer: DIN | DOUT | WKESC 1104
